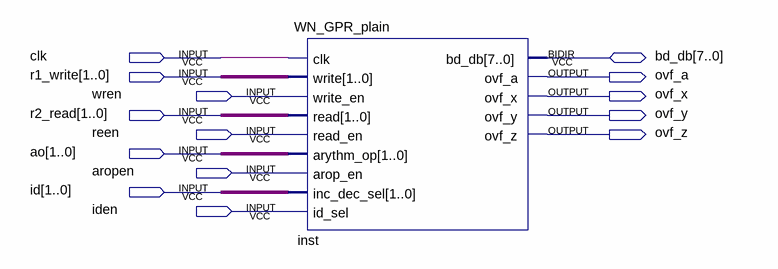
[diagram p0: schematic sheet]
// Quartus schematic WN_GPR_control.bdf as structural Verilog: 1 symbols, 14 pins
module WN_GPR_control (
  input  clk,
  input  [1:0] r1_write,
  input  wren,
  input  [1:0] r2_read,
  input  reen,
  input  [1:0] ao,
  input  aropen,
  input  [1:0] id,
  input  iden,
  inout  [7:0] bd_db,
  output ovf_a,
  output ovf_x,
  output ovf_y,
  output ovf_z
);

  WN_GPR_plain inst (
    .clk(clk), .write(r1_write), .write_en(wren), .read(r2_read), .read_en(reen), .arythm_op(ao),
    .arop_en(aropen), .inc_dec_sel(id), .id_sel(iden), .ovf_a(ovf_a), .ovf_x(ovf_x), .ovf_y(ovf_y),
    .ovf_z(ovf_z), .bd_db(bd_db));
endmodule
